# Altium schematic sheet SoftCore_SA_P4.SchDoc: =ProjectTitle
size B; Engineer: Hab S Collector; Address1: 3621 Gin Way; Address2: Snellville GA, 30039; SheetNumber: 4; SheetTotal: 7
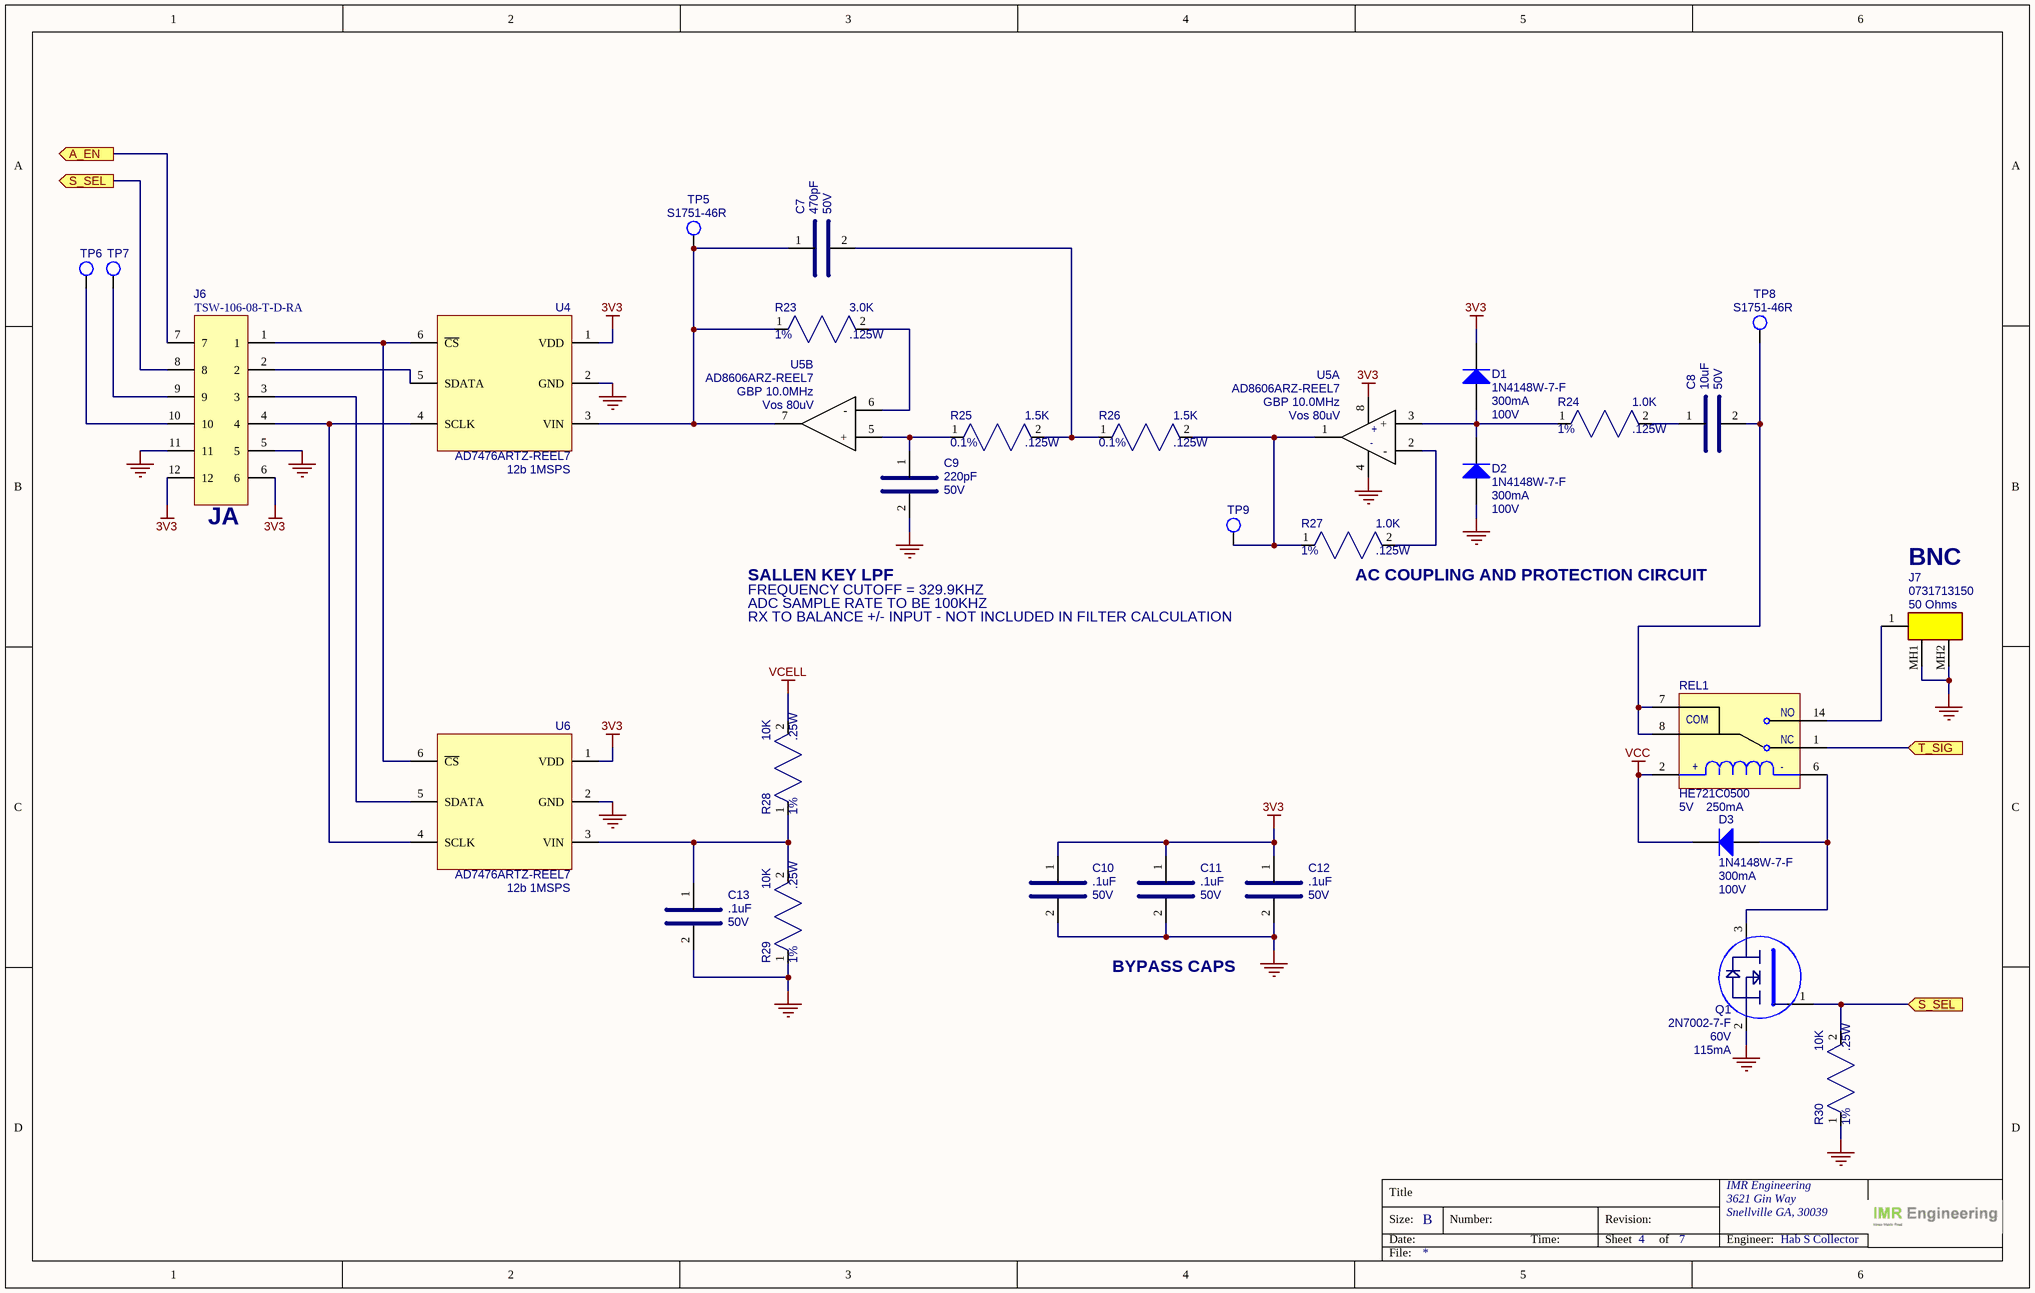
[diagram p0: SoftCore_SA_P4.SchDoc]

## Parts
C7  value 470pF  Voltage: 50V  [CAP_0805]  (hidden comment: CC0805JRNPO9BN471)
C8  value 10uF  Voltage: 50V  [CAP_0805]  (hidden comment: GRM21BR61H106KE43L)
C9  value 220pF  Voltage: 50V  [CAP_0805]  (hidden comment: CC0805JRNPO9BN221)
C10  value .1uF  Voltage: 50V  [CAP_0805]  (hidden comment: KGM21NR71H104KT)
C11  value .1uF  Voltage: 50V  [CAP_0805]  (hidden comment: KGM21NR71H104KT)
C12  value .1uF  Voltage: 50V  [CAP_0805]  (hidden comment: KGM21NR71H104KT)
C13  value .1uF  Voltage: 50V  [CAP_0805]  (hidden comment: KGM21NR71H104KT)
D1  value 100V  Current: 300mA  [SOD123]  (hidden comment: 1N4148W-7-F)
D2  value 100V  Current: 300mA  [SOD123]  (hidden comment: 1N4148W-7-F)
D3  value 100V  Current: 300mA  [SOD123]  (hidden comment: 1N4148W-7-F)
J6  TSW-106-08-T-D-RA  [SAMTEC_TSW-106-08-T-D-RA]
J7  value 50 Ohms  [731713150]  (hidden comment: 0731713150)
Q1  value 60V  Current: 115mA  [SOT-23]  (hidden comment: 2N7002-7-F)
R23  value 3.0K  Power: .125W  Tolerance: 1%  [RES_0805]  (hidden comment: RC0805FR-133KL)
R24  value 1.0K  Power: .125W  Tolerance: 1%  [RES_0805]  (hidden comment: RC0805FR-071KL)
R25  value 1.5K  Power: .125W  Tolerance: 0.1%  [RES_0805]  (hidden comment: RT0805BRD071K5L)
R26  value 1.5K  Power: .125W  Tolerance: 0.1%  [RES_0805]  (hidden comment: RT0805BRD071K5L)
R27  value 1.0K  Power: .125W  Tolerance: 1%  [RES_0805]  (hidden comment: RC0805FR-071KL)
R28  value 10K  Power: .25W  Tolerance: 1%  [RES_0805]  (hidden comment: RC0805FR-7W10KL)
R29  value 10K  Power: .25W  Tolerance: 1%  [RES_0805]  (hidden comment: RC0805FR-7W10KL)
R30  value 10K  Power: .25W  Tolerance: 1%  [RES_0805]  (hidden comment: RC0805FR-7W10KL)
REL1  value 5V  Current: 250mA  [HE700]  (hidden comment: HE721C0500)
TP5  S1751-46R  [HARWIN_S1751]
TP6  (no value)  [TEST_POINT_20MIL_TH]  (no BOM)
TP7  (no value)  [TEST_POINT_20MIL_TH]  (no BOM)
TP8  S1751-46R  [HARWIN_S1751]
TP9  (no value)  [TEST_POINT_20MIL_TH]  (no BOM)
U4  value 12b 1MSPS  [SOT-23-6]  (hidden comment: AD7476ARTZ-REEL7)
U5  value GBP 10.0MHz  Vos: Vos 80uV  [SOIC-8_54]  (hidden comment: AD8606ARZ-REEL7)  (parts A,B of 2)
U6  value 12b 1MSPS  [SOT-23-6]  (hidden comment: AD7476ARTZ-REEL7)

## Ports
A_EN (out), S_SEL (in), S_SEL (out), T_SIG (in)

## Nets
3V3: C10.1 C11.1 C12.1 D1.2(K) J6.6 J6.12 U4.1(VDD) U5.8 U6.1(VDD)
GND: C9.2 C10.2 C11.2 C12.2 C13.2 D2.1(A) J6.5 J6.11 J7.MH1 J7.MH2 Q1.2(E) R29.1 R30.1 U4.2(GND) U5.4 U6.2(GND)
VCC: D3.2(K) REL1.2
VCELL: R28.2
A_EN: J6.7 ; port A_EN
S_SEL: J6.8 Q1.1(B) R30.2 ; port S_SEL
T_SIG: REL1.1(NC) ; port T_SIG
NetC7_1: C7.1 R23.1 TP5.1 U4.3(VIN) U5.7
NetC7_2: C7.2 R25.2 R26.1
NetC8_1: C8.1 R24.2
NetC8_2: C8.2 REL1.7(COM) REL1.8(COM) TP8.1
NetC9_1: C9.1 R25.1 U5.5(+)
NetC13_1: C13.1 R28.1 R29.2 U6.3(VIN)
NetD1_1: D1.1(A) D2.2(K) R24.1 U5.3(+)
NetD3_1: D3.1(A) Q1.3(C) REL1.6
NetJ6_1: J6.1 U4.6(~{CS}) U6.6(~{CS})
NetJ6_2: J6.2 U4.5(SDATA)
NetJ6_3: J6.3 U6.5(SDATA)
NetJ6_4: J6.4 U4.4(SCLK) U6.4(SCLK)
NetJ6_9: J6.9 TP7.1
NetJ6_10: J6.10 TP6.1
NetJ7_1: J7.1 REL1.14(NO)
NetR23_2: R23.2 U5.6(-)
NetR26_2: R26.2 R27.1 TP9.1 U5.1
NetR27_2: R27.2 U5.2(-)

## Notes on the sheet
- (near J6) JA
- BNC
- SALLEN KEY LPF
- FREQUENCY CUTOFF = 329.9KHZ
- ADC SAMPLE RATE TO BE 100KHZ
- RX TO BALANCE +/- INPUT - NOT INCLUDED IN FILTER CALCULATION
- (near R27) AC COUPLING AND PROTECTION CIRCUIT
- BYPASS CAPS
- Title
- Size:
- Date:
- B
- Number:
- Time:
- Revision:
- Sheet
- of
- IMR Engineering
- Engineer:
- File:
- (in symbol RELAY_HE721C0500) +; -

## Library data of the parts
C7 = CAP_SMD_470PF_50V_0805: CAP CER 470PF 50V COG/NP0 0805; MFG: Yageo; Type: COG, NP0; Tolerance: 5%; Case/Package: 0805; MFG_PN: CC0805JRNPO9BN471; Supplier 1: DigiKey; Supplier Part Number 1: 311-1119-1-ND; Unit Price: .11
C8 = CAP_SMD_10UF_50V_0805: CAP CER 10UF 50V X5R 0805; MFG: Murata Electronics; Case/Package: 0805; MFG_PN: GRM21BR61H106KE43L; Supplier 1: DigiKey; Supplier Part Number 1: 490-18663-1-ND; Unit Price: .28
C9 = CAP_SMD_220PF_50V_0805: CAP CER 220PF 50V COG/NP0 0805; MFG: Yageo; Type: COG, NP0; Tolerance: 5%; Case/Package: 0805; MFG_PN: CC0805JRNPO9BN221; Supplier 1: DigiKey; Supplier Part Number 1: 311-1115-1-ND; Unit Price: .11
C10-C13 = CAP_SMD_0.1UF_50V_0805: CAP CER 0.1UF 50V X7R 0805; MFG: KYOCERA AVX; Case/Package: 0805; MFG_PN: KGM21NR71H104KT; Supplier 1: DigiKey; Supplier Part Number 1: 478-KGM21NR71H104KTCT-ND; Unit Price: .1
D1-D3 = DIODE_1N4148W-7-F: RELAY REED SPDT 250MA 5V; MFG: Diodes Inc; Case/Package: SOD-123; Supplier 1: DigiKey; Supplier Part Number 1: 1N4148W-FDICT-ND; Unit Price: .16; MFG_PN: 1N4148W-7-F
J6 = CONN_HEADER_12P_100MIL_RA: CONN HEADER R/A 12POS 2.54MM; MFG: Samtec Inc.; Case/Package: 2P_2.54MM; Supplier 1: Digi-Key; Supplier Part Number 1: SAM1049-06-ND; Unit Price: .93; MFG_PN: TSW-106-08-T-D-RA
J7 = CONN_MOLEX_0731713150: CONN BNC RCPT R/A 50 OHM PCB; MFG: Molex; Case/Package: 73099-2; Supplier 1: DigiKey; Supplier Part Number 1: WM20430-ND; Unit Price: 1.40; MFG_PN: 0731713150
Q1 = MOSFET_NCH_2N7002-7-F: MOSFET N-CH 60V 115MA SOT23-3; MFG: Diodes Inc; Case/Package: SOT-23; Supplier 1: DigiKey; Supplier Part Number 1: 2N7002-FDICT-ND; Unit Price: .20; MFG_PN: 2N7002-7-F
R23 = RES_SMD_3.0K_0805_1/8W_1%: RES SMD 3.0K OHM 1% 1/8W 0805; MFG: Yageo; Case/Package: 0805; MFG_PN: RC0805FR-133KL; Supplier 1: DigiKey; Supplier Part Number 1: 13-RC0805FR-133KLCT-ND; Unit Price: .1
R24 R27 = RES_SMD_1.0K_0805_1/8W_1%: RES SMD 1.0K OHM 1% 1/8W 0805; MFG: Yageo; Case/Package: 0805; MFG_PN: RC0805FR-071KL; Supplier 1: DigiKey; Supplier Part Number 1: 311-1.00KCRCT-ND; Unit Price: .1
R25 R26 = RES_SMD_1.5K_0805_1/8W_0.1%: RES SMD 1.5K OHM 0.1% 1/8W 0805; MFG: Yageo; Case/Package: 0805; MFG_PN: RT0805BRD071K5L; Supplier 1: DigiKey; Supplier Part Number 1: YAG1814CT-ND; Unit Price: .16
R28-R30 = RES_SMD_10K_0805_1/4W_1%: RES SMD 10K OHM 1% 1/4W 0805; MFG: Yageo; Case/Package: 0805; MFG_PN: RC0805FR-7W10KL; Supplier 1: DigiKey; Supplier Part Number 1: 13-RC0805FR-7W10KLCT-ND; Unit Price: .10
REL1 = RELAY_HE721C0500: RELAY REED SPDT 250MA 5V; MFG: Littlefuse; Case/Package: HE700; Supplier 1: DigiKey; Supplier Part Number 1: HE112-ND; Unit Price: 3.77; MFG_PN: HE721C0500
TP5 TP8 = CONN_TEST_POINT_S1751-46R: PCB TEST POINT CONNECT; MFG: Harwin Inc; Case/Package: S1751; Supplier 1: Digi-Key; Supplier Part Number 1: 952-1478-1-ND; Value: *; Unit Price: .28; MFG_PN: S1751-46R
TP6 TP7 TP9 = CONN_TEST_POINT_TH_PAD_20MIL: TEST POINT TH 20MIL HOLE
U4 U6 = IC_AD7476ARTZ-REEL7: IC ADC 12BIT SAR SOT23-6; MFG: Analog Devices; Case/Package: SOT-23-6; Supplier 1: DigiKey; Supplier Part Number 1: AD7476ARTZ-REEL7CT-ND; Unit Price: 12.02; MFG_PN: AD7476ARTZ-REEL7
U5 = IC_OPAMP_AD8606ARZ-REEL7: IC OPAMP GP 2 CIRCUIT 8SOIC; MFG: Analog Devices; Unit Price: 4.94; Package/Case: SOIC-8; Supplier 1: DigiKey; Supplier Part Number 1: AD8606ARZ-REEL7CT-ND; MFG_PN: AD8606ARZ-REEL7